# Altium schematic sheet con-board-jtag.SchDoc
size A4; SheetNumber: 35; SheetTotal: 41
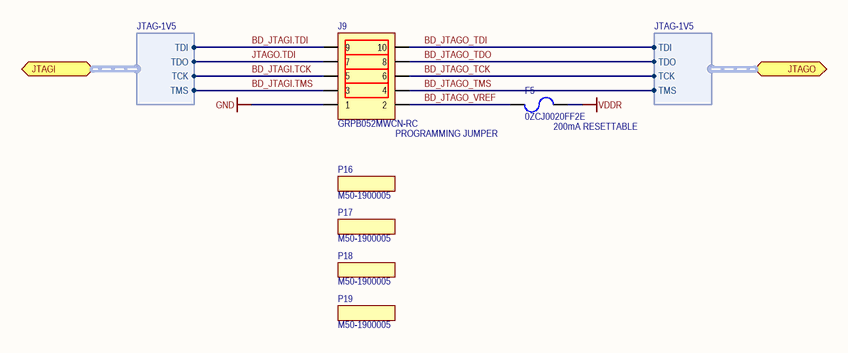
[diagram p0: con-board-jtag.SchDoc]

## Parts
F5  0ZCJ0020FF2E  [1206]
J9  GRPB052MWCN-RC  [GRPB052MWCN]
P16  M50-1900005  (mechanical)
P17  M50-1900005  (mechanical)
P18  M50-1900005  (mechanical)
P19  M50-1900005  (mechanical)

## Ports
JTAGI (harness JTAG-1V5), JTAGO (harness JTAG-1V5)

## Harnesses
JTAG-1V5: TMS, TCK, TDI, TDO

## Nets
GND: J9.1
VDDR: F5.1
BD_JTAGI.TCK: J9.5 ; port JTAGI.TCK
BD_JTAGI.TDI: J9.9 ; port JTAGI.TDI
BD_JTAGI.TMS: J9.3 ; port JTAGI.TMS
BD_JTAGO_TCK: J9.6 ; port JTAGO.TCK
BD_JTAGO_TDI: J9.10 ; port JTAGO.TDI
BD_JTAGO_TDO: J9.8 ; port JTAGO.TDO
BD_JTAGO_TMS: J9.4 ; port JTAGO.TMS
BD_JTAGO_VREF: F5.2 J9.2
JTAGO.TDI: J9.7 ; port JTAGI.TDO

## Notes on the sheet
- (near J9) PROGRAMMING JUMPER
- (near F5) 200mA RESETTABLE

## Library data of the parts
F5 = 0ZCJ0020FF2E: PTC Resettable Fuse, 0.2A, 30V, SMD 1206; Manufacturer: Bell Fuse; Manufacturer P/N: 0ZCJ0020FF2E
J9 = GRPB052MWCN-RC: Male Header, 0.050" Pitch, Right Angle, 2x5 Position; Manufacturer: Sullins; Manufacturer P/N: GRPB052MWCN-RC
P16-P19 = M50-1900005: 1.27mm Jumper Socket; Manufacturer: Harwin; Manufacturer P/N: M50-1900005